# EAGLE design Soapbox_of (EAGLE 9.6.0)
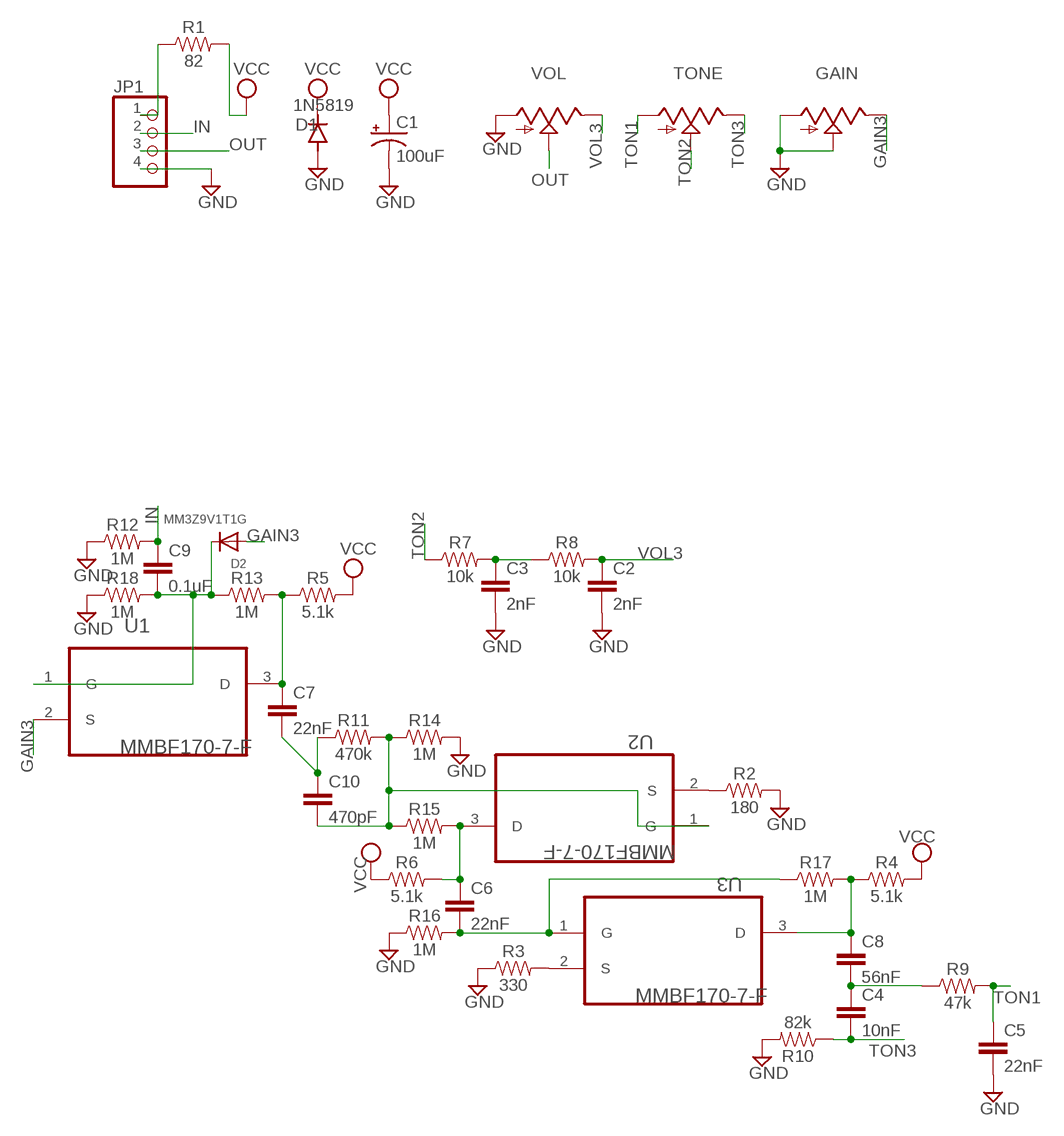
[diagram p0: schematic, sheet 1]

## Parts
C1  100uF  CAP_SMD+THRUPAN_B  [PAN_B_SMD+THRU]
C2  2nF  2.2NF/2200PF-0603-50V-10%  [0603]
C3  2nF  2.2NF/2200PF-0603-50V-10%  [0603]
C4  10nF  10NF-0603-50V-10%  [0603]
C5  22nF  22NF/22,000PF-0603-50V-10%  [0603]
C6  22nF  22NF/22,000PF-0603-50V-10%  [0603]
C7  22nF  22NF/22,000PF-0603-50V-10%  [0603]
C8  56nF  47NF-0603-25V-5%  [0603]
C9  0.1uF  0.1UF-0603-25V-(+80/-20%)  [0603]
C10  470pF  470PF-0603-50V-5%  [0603]
D1  1N5819  DIODE-SOD123  [SOD123]
D2  MM3Z9V1T1G  DIODESOD-323F  [SOD-323F]
GAIN  9MM_SNAP-IN_POT_  [9MM_SNAP-IN_POT]
JP1  PINHD-1X4  [1X04]
R1  82  82OHM-0603-1/10W-1%  [0603]
R2  180  180OHM-0603-1/10W-1%  [0603]
R3  330  330OHM-0603-1/10W-1%  [0603]
R4  5.1k  5.6KOHM-0603-1/10W-1%  [0603]
R5  5.1k  5.6KOHM-0603-1/10W-1%  [0603]
R6  5.1k  5.6KOHM-0603-1/10W-1%  [0603]
R7  10k  10KOHM-0603-1/10W-1%  [0603]
R8  10k  10KOHM-0603-1/10W-1%  [0603]
R9  47k  47KOHM-0603-1/10W-1%  [0603]
R10  82k  82OHM-0603-1/10W-1%  [0603]
R11  470k  470OHM-0603-1/10W-1%  [0603]
R12  1M  1MOHM-0603-1/4W-5%  [0603]
R13  1M  1MOHM-0603-1/4W-5%  [0603]
R14  1M  1MOHM-0603-1/4W-5%  [0603]
R15  1M  1MOHM-0603-1/4W-5%  [0603]
R16  1M  1MOHM-0603-1/4W-5%  [0603]
R17  1M  1MOHM-0603-1/4W-5%  [0603]
R18  1M  1MOHM-0603-1/4W-5%  [0603]
TONE  9MM_SNAP-IN_POT_  [9MM_SNAP-IN_POT]
U1  MMBF170-7-F  [SOT103P240X110-3N]
U2  MMBF170-7-F  [SOT103P240X110-3N]
U3  MMBF170-7-F  [SOT103P240X110-3N]
VOL  9MM_SNAP-IN_POT_  [9MM_SNAP-IN_POT]

## Nets
GAIN3: D2.A GAIN.3(E) U1.2(S)
GND: C1.- C1.--(-) C2.2 C3.2 C5.2 D1.A GAIN.1(A) GAIN.2(S) JP1.4 R2.2 R3.1 R10.2 R12.1 R14.2 R16.1 R18.1 VOL.1(A)
IN: C9.1 JP1.2 R12.2
N$1: C9.2 D2.C R13.1 R18.2 U1.1(G)
N$2: JP1.1 R1.1
N$3: R2.1 U2.2(S)
N$4: C7.1 R5.1 R13.2 U1.3(D)
N$5: C7.2 C10.1 R11.1
N$6: C10.2 R11.2 R14.1 R15.1 U2.1(G)
N$7: C6.1 R6.2 R15.2 U2.3(D)
N$8: C6.2 R16.2 R17.1 U3.1(G)
N$9: C8.1 R4.1 R17.2 U3.3(D)
N$10: C4.1 C8.2 R9.1
N$11: R3.2 U3.2(S)
N$12: C3.1 R7.2 R8.1
OUT: JP1.3 VOL.2(S)
TON1: C5.1 R9.2 TONE.1(A)
TON2: R7.1 TONE.2(S)
TON3: C4.2 R10.1 TONE.3(E)
VCC: C1.+ C1.++(+) D1.C R1.2 R4.2 R5.2 R6.1
VOL3: C2.1 R8.2 VOL.3(E)

## Library data of the parts
C1 = MusicThingModular:CAP_SMD+THRU
C2 C3 = SparkFun-Capacitors:2.2NF/2200PF: 2.2nF/2,200pF ceramic capacitors A capacitor is a passive two-terminal electrical component used to store electrical energy temporarily in an electric field.; PROD_ID: CAP-07877; VALUE: 2.2nF
C4 = SparkFun-Capacitors:10NF: 0.01uF/10nF/10,000pF ceramic capacitors A capacitor is a passive two-terminal electrical component used to store electrical energy temporarily in an electric field. CAP-09321; PROD_ID: CAP-00867
C5-C7 = SparkFun-Capacitors:22NF/22,000PF: 0.022uF/22nF/22,000pF ceramic capacitors A capacitor is a passive two-terminal electrical component used to store electrical energy temporarily in an electric field.; PROD_ID: CAP-07885
C8 = SparkFun-Capacitors:47NF: 47nF ceramic capacitors A capacitor is a passive two-terminal electrical component used to store electrical energy temporarily in an electric field.; PROD_ID: CAP-08605; VALUE: 47nF
C9 = SparkFun-Capacitors:0.1UF: 0.1µF ceramic capacitors A capacitor is a passive two-terminal electrical component used to store electrical energy temporarily in an electric field.; PROD_ID: CAP-00810
C10 = SparkFun-Capacitors:470PF: 470pF ceramic capacitors A capacitor is a passive two-terminal electrical component used to store electrical energy temporarily in an electric field.; PROD_ID: CAP-07884
D1 = diode:DIODE-: DIODE
D2 = adafruit:DIODE: Diode SMADIODE - SMA Surface Mount Package 20V 1A Schottky Diode Digikey: 641-1014-6-ND DO-1N4148 - Through Hole Small Current Diode SOD-123 20V 1 A (.5mV Vf) Schottky Diode - Digikey: MBRX120TPMSCT-ND SOD-323 10V 570mA (.38mV Vf, 3ns) Schottky Diode - Digikey: ZLLS410CT-ND SOD-523 30V 30mA Schottky Diode (RB751S-40TE61) - Digikey: RB751S-40TE61CT-ND SOT23-R/W - SOT23 Package (R = Solder Paste/Reflow Ovens, W = Hand-Soldering) BAT54Film 40V 300mA - Digikey: 497-7162-1-ND
GAIN TONE VOL = MusicThingModular:9MM_SNAP-IN_POT: 9mm vertical snap-in pot, Alpha / Panasonic style
JP1 = Connector:PINHD-1X4: PIN HEADER; CATEGORY: CONNECTOR; SUB-CATEGORY: PIN-HEADER
R1 = SparkFun-Resistors:82OHM: 82Ω resistor A resistor is a passive two-terminal electrical component that implements electrical resistance as a circuit element. Resistors act to reduce current flow, and, at the same time, act to lower voltage levels within circuits. - Wikipedia; PROD_ID: RES-12311
R2 = SparkFun-Resistors:180OHM: 180Ω resistor A resistor is a passive two-terminal electrical component that implements electrical resistance as a circuit element. Resistors act to reduce current flow, and, at the same time, act to lower voltage levels within circuits. - Wikipedia; PROD_ID: RES-08788
R3 = SparkFun-Resistors:330OHM: 330Ω resistor A resistor is a passive two-terminal electrical component that implements electrical resistance as a circuit element. Resistors act to reduce current flow, and, at the same time, act to lower voltage levels within circuits. - Wikipedia; PROD_ID: RES-00818
R4-R6 = SparkFun-Resistors:5.6KOHM: 5.6kΩ resistor A resistor is a passive two-terminal electrical component that implements electrical resistance as a circuit element. Resistors act to reduce current flow, and, at the same time, act to lower voltage levels within circuits. - Wikipedia; PROD_ID: RES-12378; VALUE: 5.6k
R7 R8 = SparkFun-Resistors:10KOHM: 10kΩ resistor A resistor is a passive two-terminal electrical component that implements electrical resistance as a circuit element. Resistors act to reduce current flow, and, at the same time, act to lower voltage levels within circuits. - Wikipedia; PROD_ID: RES-00824
R9 = SparkFun-Resistors:47KOHM: 47kΩ resistor A resistor is a passive two-terminal electrical component that implements electrical resistance as a circuit element. Resistors act to reduce current flow, and, at the same time, act to lower voltage levels within circuits. - Wikipedia; PROD_ID: RES-07871
R10 = SparkFun-Resistors:82OHM: 82Ω resistor A resistor is a passive two-terminal electrical component that implements electrical resistance as a circuit element. Resistors act to reduce current flow, and, at the same time, act to lower voltage levels within circuits. - Wikipedia; PROD_ID: RES-12311; VALUE: 82
R11 = SparkFun-Resistors:470OHM: 470Ω resistor A resistor is a passive two-terminal electrical component that implements electrical resistance as a circuit element. Resistors act to reduce current flow, and, at the same time, act to lower voltage levels within circuits. - Wikipedia; PROD_ID: RES-07869; VALUE: 470
R12-R18 = SparkFun-Resistors:1MOHM: 1MΩ resistor A resistor is a passive two-terminal electrical component that implements electrical resistance as a circuit element. Resistors act to reduce current flow, and, at the same time, act to lower voltage levels within circuits. - Wikipedia; PROD_ID: RES-07868
U1-U3 = MMBF170-7-F:MMBF170-7-F: N-CHANNEL ENHANCEMENT MODE FIELD EFFECT TRANSISTOR; AVAILABILITY: Unavailable; DESCRIPTION: N-Channel 60V 500mA _Ta_ 300mW _Ta_ Surface Mount SOT-23-3; MF: Diodes Inc.; MP: MMBF170-7-F; PACKAGE: SOT-23-3 Diodes Inc.; PRICE: None

## Board
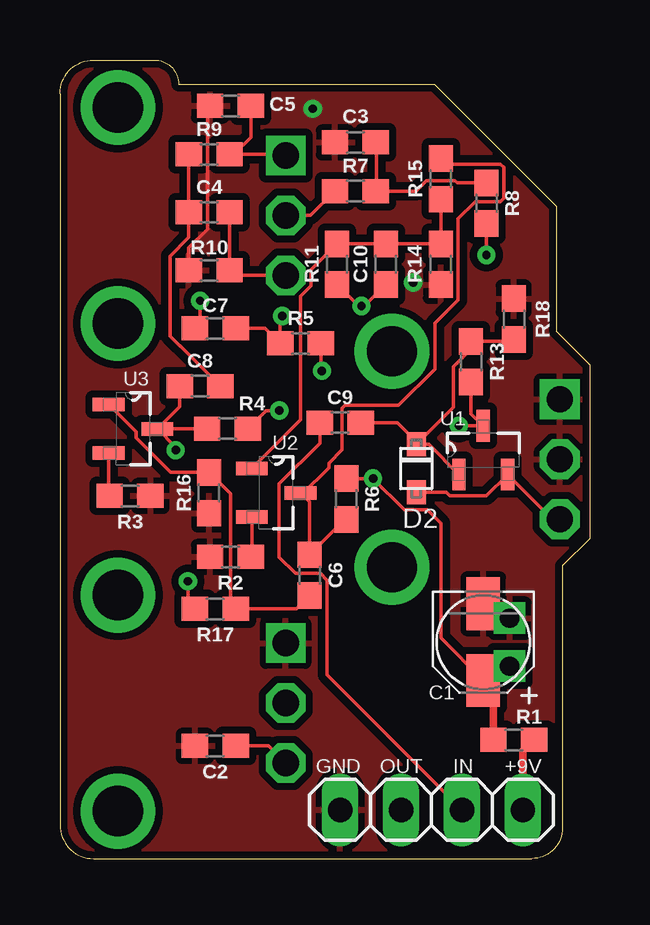
[diagram p1: board, top side]
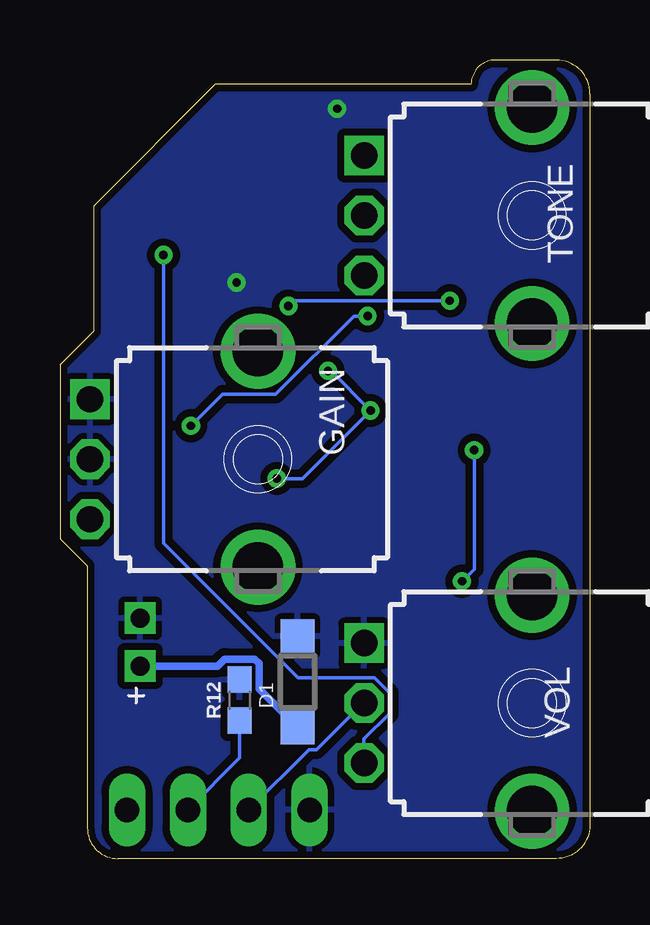
[diagram p2: board, bottom side, seen from below]

Size 22.1 x 33.27 mm. Coordinates in mm from the lower left corner, seen from the top.
Outline: 1.4,0 19.68,0 arc90 20.95,1.27 20.95,12.19 22.1,13.34 22.1,20.57 20.7,21.97 20.7,27.18 15.62,32.26 4.95,32.26 arc90 3.94,33.27 1.4,33.27 arc90 0,31.88 0,1.4 arc90 1.4,0
Copper layers (1*16): Top 0.035mm / dielectric 1.5mm / Bottom 0.035mm
Design rules "default *": minimum track width 6mil, minimum drill 0.35mm, track to track 6mil, track to pad 6mil, pad to pad 6mil, via to via 6mil, smd to smd 6mil, copper to edge 7mil, drill to drill 6mil, minimum pad ring 10mil, minimum via ring 8mil, stop-mask expansion 4mil, vias tented up to drill 0mil, thermal gap 10mil

### Footprints (pad centres in the part's own frame; a part is rotated, then mirrored left to right if it is on the bottom)
PAN_B_SMD+THRU = smd 2.2 x 1.4: + 1.6,0; - -1.6,0 | drill 0.8 pad 0.9 square: ++ 1,1.1; -- -1,1.1
0603 = smd 1.1 x 1: 1 -0.85,0; 2 0.85,0
SOD123 = smd 1.4 x 1.4: A 1.9,0; C -1.9,0
SOD-323F = smd 1 x 0.8: A -1,0; C 1,0
9MM_SNAP-IN_POT = drill 1.1 square: 1 -2.5,-7 | drill 1.1 octagon: 2 0,-7; 3 2.5,-7 | drill 2.1 pad 2.794: CHASSIS1 -4.5,0; CHASSIS2 4.5,0
1X04 = drill 1.016 long: 1 -3.81,0; 2 -1.27,0; 3 1.27,0; 4 3.81,0
SOT103P240X110-3N = smd 1.321 x 0.559: 1 -1.016,1.016; 2 -1.016,-1.016; 3 1.016,0

### Placement (x,y rotation side)
C1  17.65,9.02 270 top
C2  6.48,4.7 180 top
C3  12.32,29.84 180 top
C4  6.22,26.92 0 top
C5  7.11,31.37 180 top
C6  10.41,11.81 270 top
C7  6.48,22.1 180 top
C8  5.84,19.68 0 top
C9  11.68,18.16 0 top
C10  13.59,24.77 90 top
D1  12.19,7.37 90 bottom
D2  14.86,16.26 90 top
GAIN  13.84,16.64 270 bottom
JP1  15.49,2.03 180 top
R1  18.92,4.95 180 top
R2  7.11,12.57 180 top
R3  2.92,15.11 180 top
R4  6.99,17.91 0 top
R5  10.03,21.46 0 top
R6  11.94,14.99 270 top
R7  12.32,27.81 0 top
R8  17.78,27.3 270 top
R9  6.22,29.34 0 top
R10  6.22,24.51 180 top
R11  11.56,24.77 90 top
R12  14.61,6.6 270 bottom
R13  17.14,20.7 270 top
R14  15.88,24.77 270 top
R15  15.88,28.32 90 top
R16  6.22,15.24 90 top
R17  6.48,10.41 180 top
R18  18.92,22.48 270 top
TONE  2.41,26.8 270 bottom
U1  17.65,17.02 90 top
U2  9.02,15.24 0 top
U3  3.05,17.91 0 top
VOL  2.41,6.48 270 bottom

### Tracks (layer width: path | path; a pad name or v marks a point on that pad's centre or on a via)
GAIN3
  Top 0.152: GAIN.3 20.53,14.14 U1.2 17.78,15.11 16.26,15.11 16.12,15.26 D2.A
GND  (via drill 0.35)
  Top 0.152: R10.2 5.37,25.45 6.15,26.23 6.15,31.26 C5.2
  other vias: 14.73,24 10.54,31.24
  pour Bottom (isolate 0.305): -0.51,33.66 -0.51,-0.13 0.13,-0.76 22.61,-0.76 23.11,-0.25 23.11,33.53 22.73,33.91 -0.25,33.91
  pour Top (isolate 0.305): -0.38,33.91 -0.38,-0.13 0.38,-0.89 22.35,-0.89 23.11,-0.13 23.11,33.02 22.23,33.91
IN
  Top 0.152: JP1.2 11.14,7.65 11.14,11.61 10.87,11.88 9.82,11.88 9.14,12.56 9.14,15.61 10.83,17.3 C9.1
  Bottom 0.152: JP1.2 14.61,4.19 R12.2
N$1
  Top 0.152: U1.1 15.38,17.26 14.99,17.26 | 14.99,17.26 D2.C 16.42,18.81 16.42,20.5 17.14,21.22 R13.1 18.84,21.55 R18.2 | C9.2 14.08,18.16 14.99,17.26
N$2
  Top 0.305: JP1.1 19.3,4.48 R1.1
N$3
  Top 0.152: R2.1 8,12.61 U2.2
N$4  (via drill 0.35)
  Top 0.152: R13.2 17.14,18.54 U1.3 v16.64,18.03 | C7.1 8.55,22.1 R5.1 9.18,22.52 v9.27,22.61
  Bottom 0.152: v16.64,18.03 15.32,19.35 13.1,19.35 9.85,22.61 v9.27,22.61
N$5  (via drill 0.35)
  Top 0.152: C10.1 12.7,23.03 v12.57,23.03 12.45,23.03 R11.1 | C7.2 5.84,22.31 v5.84,23.24
  Bottom 0.152: v5.84,23.24 12.57,23.24 v12.57,23.03
N$6
  Top 0.152: R15.1 R14.1 C10.2 R11.2 10.47,24.52 10.47,23.86 10.03,23.43 10.03,18.29 U2.1
N$7
  Top 0.152: R6.2 11.89,14.14 C6.1 10.41,14.86 10.1,15.18 | U2.3 10.1,15.18 | 10.1,15.18 11.21,16.29 11.21,16.48 11.76,17.03 11.76,18.76 11.89,18.89 14.12,18.89 15.63,20.4 15.63,22.3 16.6,23.27 16.6,26.65 17.33,27.38 18.38,27.38 18.51,27.51 18.51,28.8 18.38,28.93 16.11,28.93 R15.2
N$8
  Top 0.152: C6.2 9.87,10.41 R17.1 7.11,10.63 7.11,15.2 R16.2 4.62,16.09 3.17,17.53 3.17,17.78 U3.1
N$9  (via drill 0.35)
  Top 0.152: C8.1 4.99,18.84 U3.3 | U3.3 R4.1 | U3.3 4.83,17.14 v4.83,17.02 | v5.33,11.56 5.33,10.71 R17.2
  Bottom 0.152: v4.83,17.02 4.83,12.06 v5.33,11.56
N$10
  Top 0.152: R9.1 C4.1 5.37,25.88 4.59,25.11 4.59,21.76 4.98,21.37 5.01,21.37 C8.2
N$11
  Top 0.152: U3.2 2.03,15.15 R3.2
N$12
  Top 0.152: 13.21,27.81 14.84,27.81 15.28,28.25 16.47,28.25 16.56,28.16 R8.1 | 13.21,27.81 R7.2 | C3.1 13.21,29.81 13.21,27.81
OUT
  Bottom 0.152: JP1.3 11.72,4.54 11.4,4.54 9.46,6.48 VOL.2
TON1
  Top 0.152: R9.2 7.24,29.34 | 7.24,29.34 9.37,29.34 TONE.1 | C5.1 7.96,30.06 7.24,29.34
TON2
  Top 0.152: R7.1 10.45,26.8 TONE.2
TON3
  Top 0.152: C4.2 R10.1 7.29,24.3 TONE.3
VCC  (via drill 0.35)
  Top 0.152: C1.+ 15.88,9.2 15.88,13.97 15.32,14.53 14.36,14.53 v13.06,15.84 R6.1 | R4.2 8.6,18.67 v9.14,18.67 | v10.92,20.32 10.88,20.36 R5.2
  Top 0.305: R1.2 18.07,7 C1.+ 18.15,7.42 C1.++
  Bottom 0.152: v13.06,15.84 11.98,15.84 v9.14,18.67 10.79,20.32 v10.92,20.32
  Bottom 0.305: D1.C 13.8,7.07 13.8,8.13 13.98,8.31 15.23,8.31 15.52,8.02 C1.++
VOL3  (via drill 0.35)
  Top 0.152: C2.1 8.69,4.7 VOL.3 | R8.2 v17.78,25.15
  Bottom 0.152: v17.78,25.15 17.78,13.13 12.18,7.53 8.98,7.53 8.36,6.91 8.36,6.04 9.41,4.99 VOL.3

### Text on the board
tPlace: GND | OUT | IN | +9V